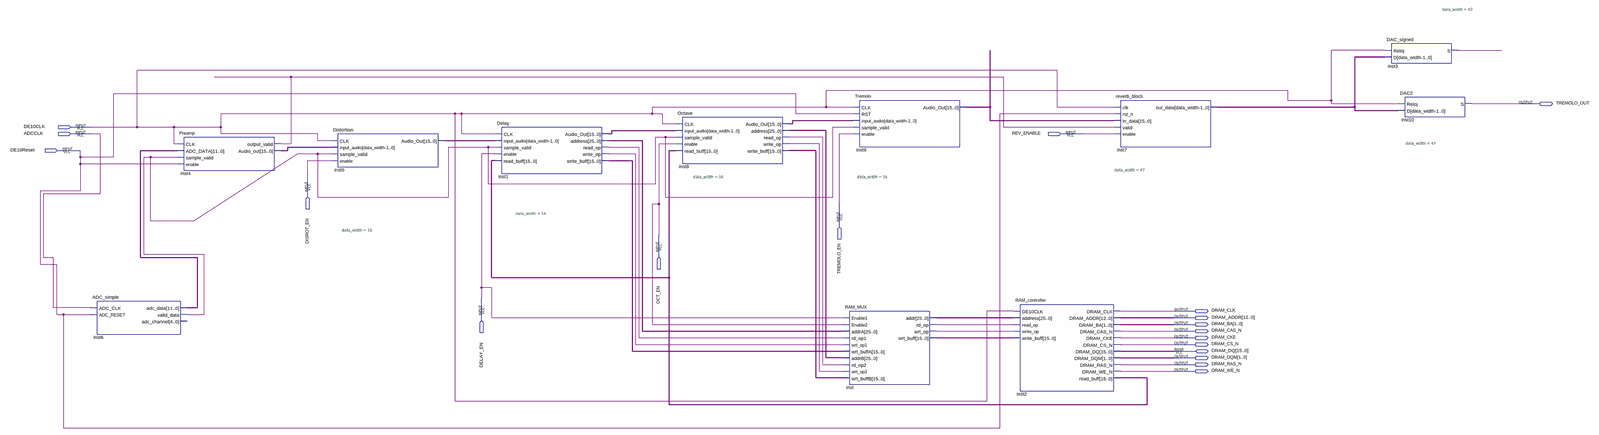
[diagram p0: schematic sheet, whole]
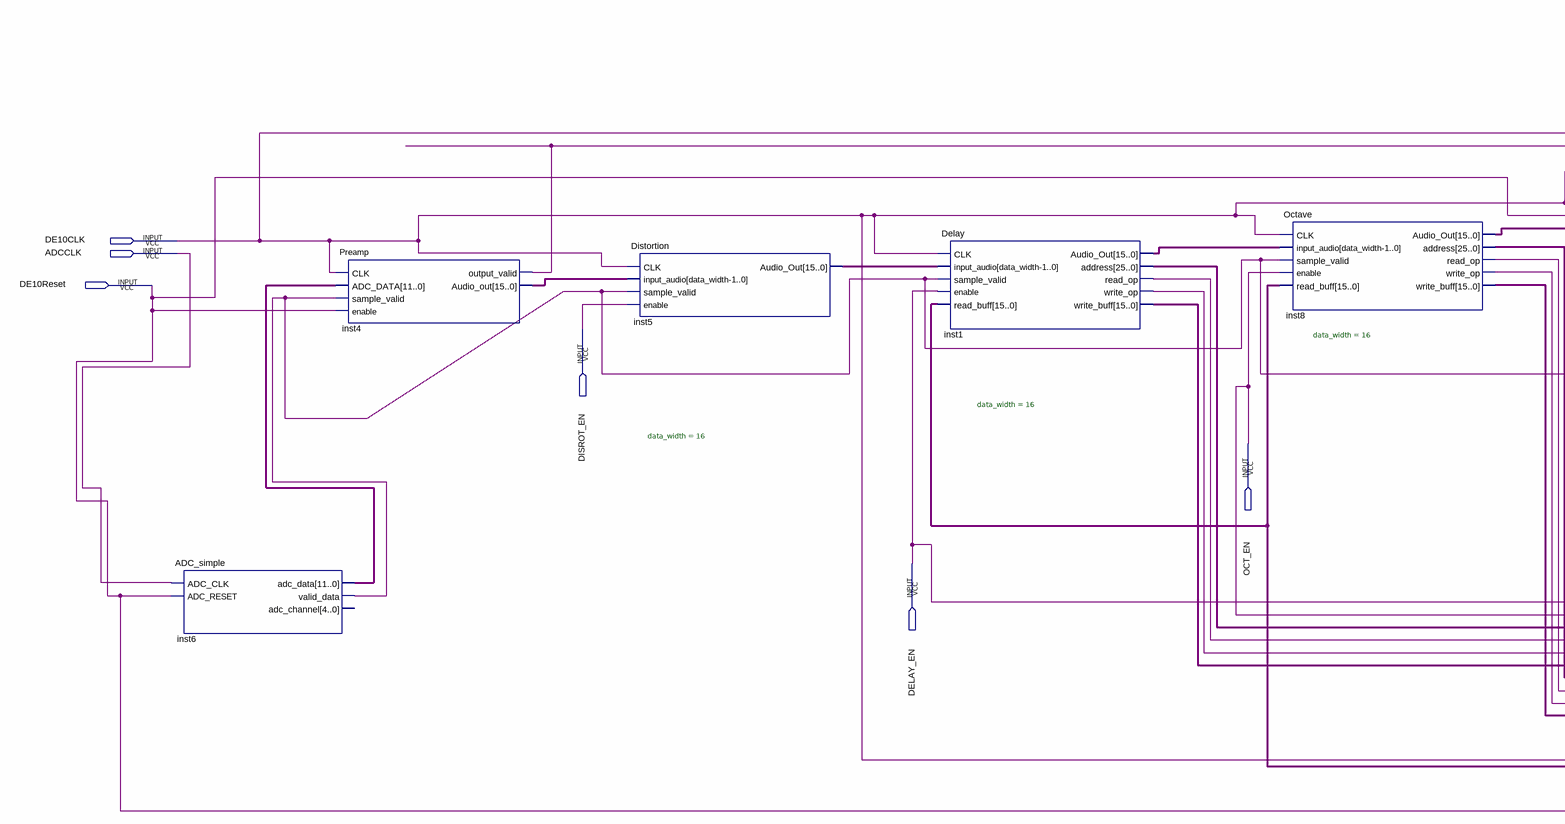
[diagram p1: schematic sheet, left part]
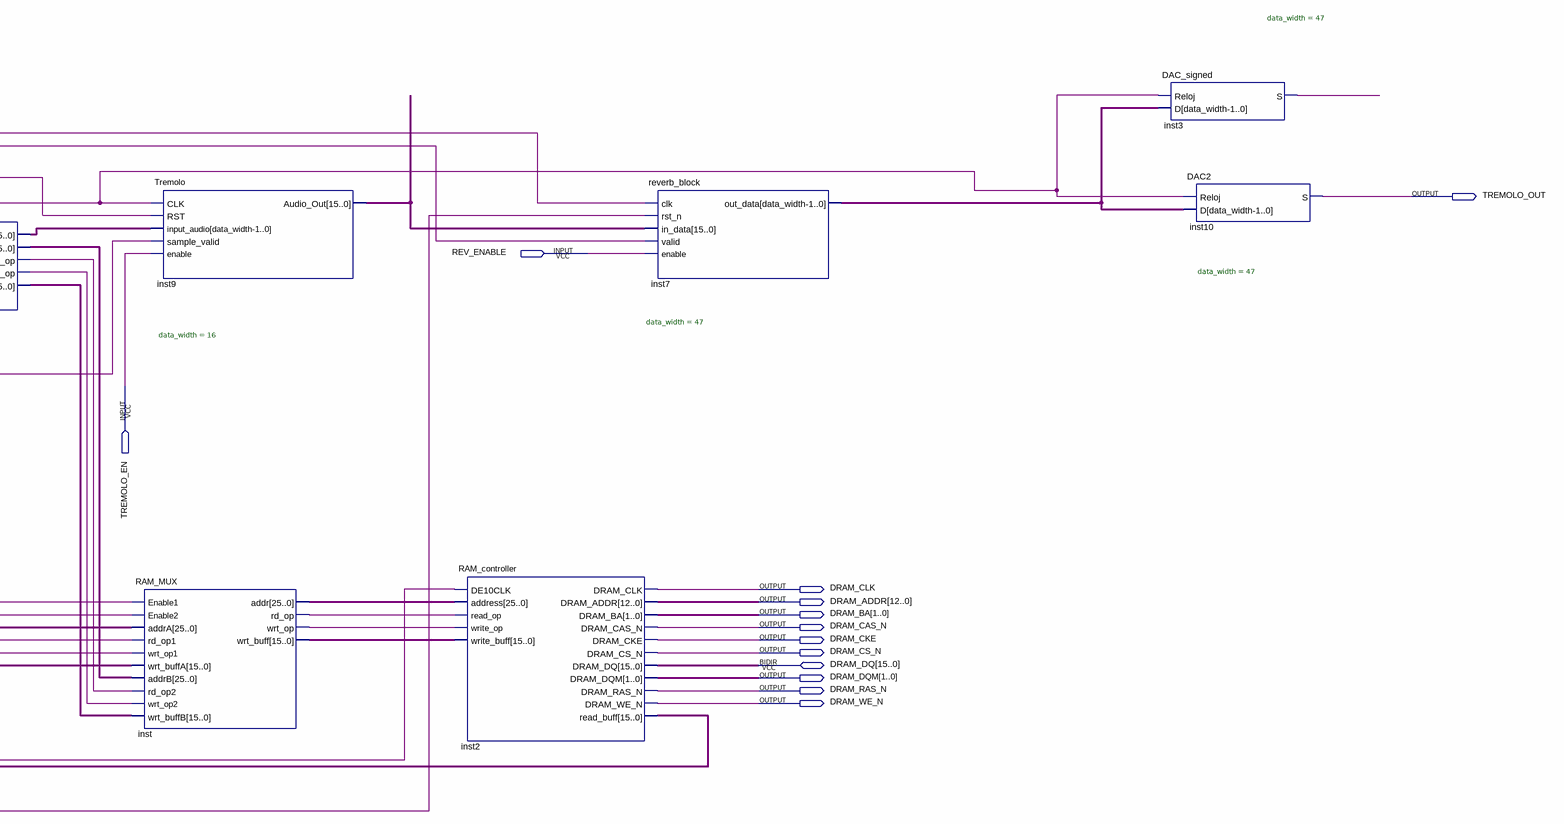
[diagram p2: schematic sheet, right part]
// Quartus schematic Effects_Pedal.bdf as structural Verilog: 11 symbols, 19 pins
module Effects_Pedal (
  input  DE10CLK,
  input  ADCCLK,
  input  REV_ENABLE,
  input  DE10Reset,
  input  DISROT_EN,
  input  TREMOLO_EN,
  input  OCT_EN,
  input  DELAY_EN,
  inout  [15:0] DRAM_DQ,
  output TREMOLO_OUT,
  output DRAM_CLK,
  output [12:0] DRAM_ADDR,
  output [1:0] DRAM_BA,
  output DRAM_CAS_N,
  output DRAM_CKE,
  output DRAM_CS_N,
  output [1:0] DRAM_DQM,
  output DRAM_RAS_N,
  output DRAM_WE_N
);

  wire inst1_read_op, inst1_write_op, inst3_s, inst4_output_valid, inst6_valid_data, inst8_read_op,
       inst8_write_op, inst_rd_op, inst_wrt_op;
  wire [11:0] inst6_adc_data;
  wire [15:0] inst1_audio_out, inst1_write_buff, inst2_read_buff, inst4_audio_out, inst5_audio_out,
       inst8_audio_out, inst8_write_buff, inst9_audio_out, inst_wrt_buff;
  wire [25:0] inst1_address, inst8_address, inst_addr;
  wire [46:0] inst7_out_data;

  ADC_simple inst6 (
    .ADC_CLK(ADCCLK), .ADC_RESET(DE10Reset), .adc_data(inst6_adc_data), .valid_data(inst6_valid_data));  // open: adc_channel
  Preamp inst4 (
    .CLK(DE10CLK), .ADC_DATA(inst6_adc_data), .sample_valid(inst6_valid_data), .enable(DE10Reset),
    .output_valid(inst4_output_valid), .Audio_out(inst4_audio_out));
  Distortion #(.data_width(16)) inst5 (
    .CLK(DE10CLK), .input_audio(inst4_audio_out), .sample_valid(inst6_valid_data), .enable(DISROT_EN),
    .Audio_Out(inst5_audio_out));
  Delay #(.data_width(16)) inst1 (
    .CLK(DE10CLK), .input_audio(inst5_audio_out), .sample_valid(inst6_valid_data), .enable(DELAY_EN),
    .read_buff(inst2_read_buff), .Audio_Out(inst1_audio_out), .address(inst1_address),
    .read_op(inst1_read_op), .write_op(inst1_write_op), .write_buff(inst1_write_buff));
  Octave #(.data_width(16)) inst8 (
    .CLK(DE10CLK), .input_audio(inst1_audio_out), .sample_valid(inst6_valid_data), .enable(OCT_EN),
    .read_buff(inst2_read_buff), .Audio_Out(inst8_audio_out), .address(inst8_address),
    .read_op(inst8_read_op), .write_op(inst8_write_op), .write_buff(inst8_write_buff));
  Tremolo #(.data_width(16)) inst9 (
    .CLK(DE10CLK), .RST(DE10Reset), .input_audio(inst8_audio_out), .sample_valid(inst6_valid_data),
    .enable(TREMOLO_EN), .Audio_Out(inst9_audio_out));
  RAM_MUX inst (
    .Enable1(DELAY_EN), .Enable2(OCT_EN), .addrA(inst1_address), .rd_op1(inst1_read_op),
    .wrt_op1(inst1_write_op), .wrt_buffA(inst1_write_buff), .addrB(inst8_address), .rd_op2(inst8_read_op),
    .wrt_op2(inst8_write_op), .wrt_buffB(inst8_write_buff), .addr(inst_addr), .rd_op(inst_rd_op),
    .wrt_op(inst_wrt_op), .wrt_buff(inst_wrt_buff));
  RAM_controller inst2 (
    .DE10CLK(DE10CLK), .address(inst_addr), .read_op(inst_rd_op), .write_op(inst_wrt_op),
    .write_buff(inst_wrt_buff), .DRAM_CLK(DRAM_CLK), .DRAM_ADDR(DRAM_ADDR), .DRAM_BA(DRAM_BA),
    .DRAM_CAS_N(DRAM_CAS_N), .DRAM_CKE(DRAM_CKE), .DRAM_CS_N(DRAM_CS_N), .DRAM_DQM(DRAM_DQM),
    .DRAM_RAS_N(DRAM_RAS_N), .DRAM_WE_N(DRAM_WE_N), .read_buff(inst2_read_buff), .DRAM_DQ(DRAM_DQ));
  reverb_block #(.data_width(47)) inst7 (
    .clk(DE10CLK), .rst_n(DE10Reset), .in_data(inst9_audio_out), .valid(inst4_output_valid),
    .enable(REV_ENABLE), .out_data(inst7_out_data));
  DAC_signed #(.data_width(47)) inst3 (.Reloj(DE10CLK), .D(inst7_out_data), .S(inst3_s));
  DAC2 #(.data_width(47)) inst10 (.Reloj(DE10CLK), .D(inst7_out_data), .S(TREMOLO_OUT));
endmodule
